# EAGLE design NixieDriver_overkill (EAGLE 7.1.0)
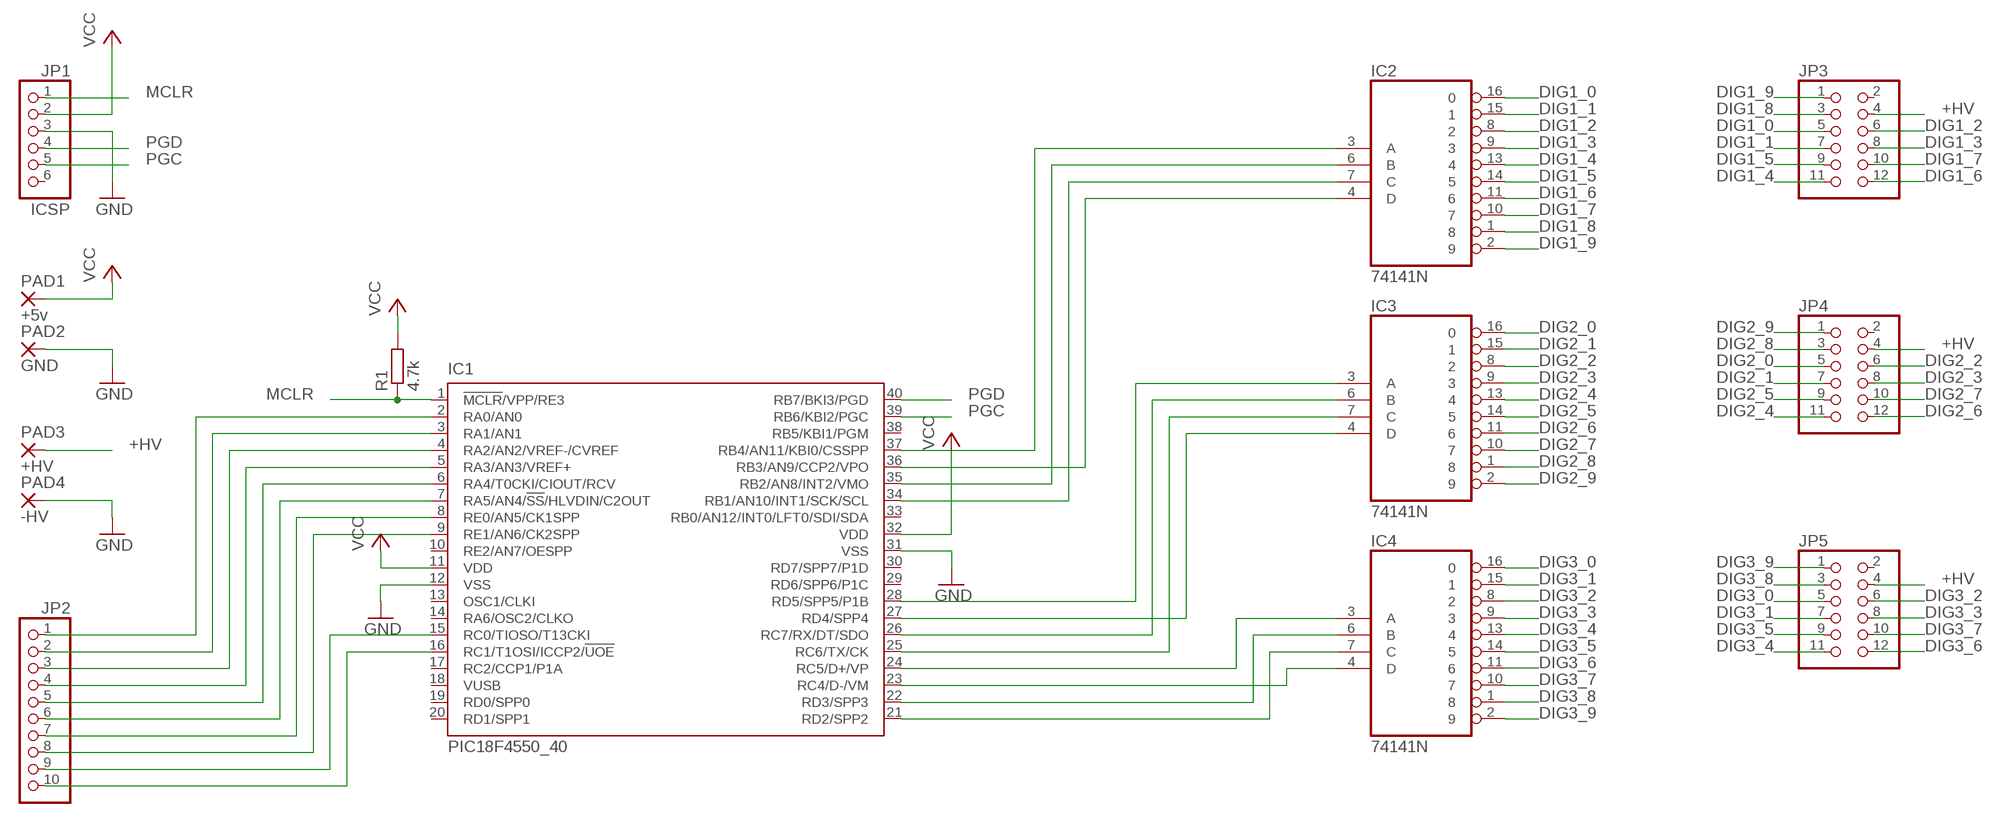
[diagram p0: schematic, sheet 1]

## Parts
IC1  PIC18F4550_40  [DIL40]
IC2  74141N  [DIL16]
IC3  74141N  [DIL16]
IC4  74141N  [DIL16]
JP1  ICSP  PINHD-1X6  [1X06]
JP2  PINHD-1X10  [1X10]
JP3  PINHD-2X6  [2X06]
JP4  PINHD-2X6  [2X06]
JP5  PINHD-2X6  [2X06]
PAD1  +5v  SMD5  [SMD2,54-5,08]
PAD2  GND  SMD5  [SMD2,54-5,08]
PAD3  +HV  SMD5  [SMD2,54-5,08]
PAD4  -HV  SMD5  [SMD2,54-5,08]
R1  4.7k  R-EU_R1206  [R1206]

## Nets
+HV: JP3.4 JP4.4 JP5.4 PAD3.1(P)
DIG1_0: IC2.16 JP3.5
DIG1_1: IC2.15 JP3.7
DIG1_2: IC2.8 JP3.6
DIG1_3: IC2.9 JP3.8
DIG1_4: IC2.13 JP3.11
DIG1_5: IC2.14 JP3.9
DIG1_6: IC2.11 JP3.12
DIG1_7: IC2.10 JP3.10
DIG1_8: IC2.1 JP3.3
DIG1_9: IC2.2 JP3.1
DIG2_0: IC3.16 JP4.5
DIG2_1: IC3.15 JP4.7
DIG2_2: IC3.8 JP4.6
DIG2_3: IC3.9 JP4.8
DIG2_4: IC3.13 JP4.11
DIG2_5: IC3.14 JP4.9
DIG2_6: IC3.11 JP4.12
DIG2_7: IC3.10 JP4.10
DIG2_8: IC3.1 JP4.3
DIG2_9: IC3.2 JP4.1
DIG3_0: IC4.16 JP5.5
DIG3_1: IC4.15 JP5.7
DIG3_2: IC4.8 JP5.6
DIG3_3: IC4.9 JP5.8
DIG3_4: IC4.13 JP5.11
DIG3_5: IC4.14 JP5.9
DIG3_6: IC4.11 JP5.12
DIG3_7: IC4.10 JP5.10
DIG3_8: IC4.1 JP5.3
DIG3_9: IC4.2 JP5.1
GND: IC1.12(VSS) IC1.31(VSS) JP1.3 PAD2.1(P) PAD4.1(P)
MCLR: IC1.1(!MCLR!/VPP/RE3) JP1.1 R1.1
N$32: IC1.24(RC5/D+/VP) IC4.3(A)
N$33: IC1.23(RC4/D-/VM) IC4.4(D)
N$34: IC1.22(RD3/SPP3) IC4.6(B)
N$35: IC1.21(RD2/SPP2) IC4.7(C)
N$36: IC1.25(RC6/TX/CK) IC3.7(C)
N$37: IC1.26(RC7/RX/DT/SDO) IC3.6(B)
N$38: IC1.27(RD4/SPP4) IC3.4(D)
N$39: IC1.28(RD5/SPP5/P1B) IC3.3(A)
N$40: IC1.34(RB1/AN10/INT1/SCK/SCL) IC2.7(C)
N$41: IC1.35(RB2/AN8/INT2/VMO) IC2.6(B)
N$42: IC1.36(RB3/AN9/CCP2/VPO) IC2.4(D)
N$43: IC1.37(RB4/AN11/KBI0/CSSPP) IC2.3(A)
N$44: IC1.2(RA0/AN0) JP2.1
N$45: IC1.3(RA1/AN1) JP2.2
N$46: IC1.4(RA2/AN2/VREF-/CVREF) JP2.3
N$47: IC1.5(RA3/AN3/VREF+) JP2.4
N$48: IC1.6(RA4/T0CKI/CIOUT/RCV) JP2.5
N$49: IC1.7(RA5/AN4/!SS!/HLVDIN/C2OUT) JP2.6
N$50: IC1.8(RE0/AN5/CK1SPP) JP2.7
N$51: IC1.9(RE1/AN6/CK2SPP) JP2.8
N$52: IC1.15(RC0/TIOSO/T13CKI) JP2.9
N$53: IC1.16(RC1/T1OSI/ICCP2/!UOE) JP2.10
PGC: IC1.39(RB6/KBI2/PGC) JP1.5
PGD: IC1.40(RB7/BKI3/PGD) JP1.4
VCC: IC1.11(VDD) IC1.32(VDD) JP1.2 PAD1.1(P) R1.2
Unconnected: IC1.10(RE2/AN7/OESPP) IC1.13(OSC1/CLKI) IC1.14(RA6/OSC2/CLKO) IC1.17(RC2/CCP1/P1A) IC1.18(VUSB) IC1.19(RD0/SPP0) IC1.20(RD1/SPP1) IC1.29(RD6/SPP6/P1C) IC1.30(RD7/SPP7/P1D) IC1.33(RB0/AN12/INT0/LFT0/SDI/SDA) IC1.38(RB5/KBI1/PGM) JP1.6 JP3.2 JP4.2 JP5.2

## Power pins joined to a net without a drawn wire
GND: IC2.12(GND) IC3.12(GND) IC4.12(GND)
VCC: IC2.5(VCC) IC3.5(VCC) IC4.5(VCC)

## Library data of the parts
IC1 = microchip:PIC18F4*_40: USB Microcontrollers with nanoWatt Technology High-Performance, Enhanced Flash, 28/40/44-Pin, Source: http://ww1.microchip.com/downloads/en/devicedoc/39632c.pdf; MF: MICROCHIP; MPN: PIC18F4550-I/P; OC_FARNELL: 9321357; OC_NEWARK: 74K8623
IC2-IC4 = 74xx-eu:74*141: BCD to decimal DECODER/DRIVER
JP1 = pinhead:PINHD-1X6: PIN HEADER
JP2 = pinhead:PINHD-1X10: PIN HEADER
JP3-JP5 = pinhead:PINHD-2X6: PIN HEADER
PAD1-PAD4 = wirepad:SMD5: SMD PAD
R1 = rcl:R-EU_: RESISTOR, European symbol

## Board
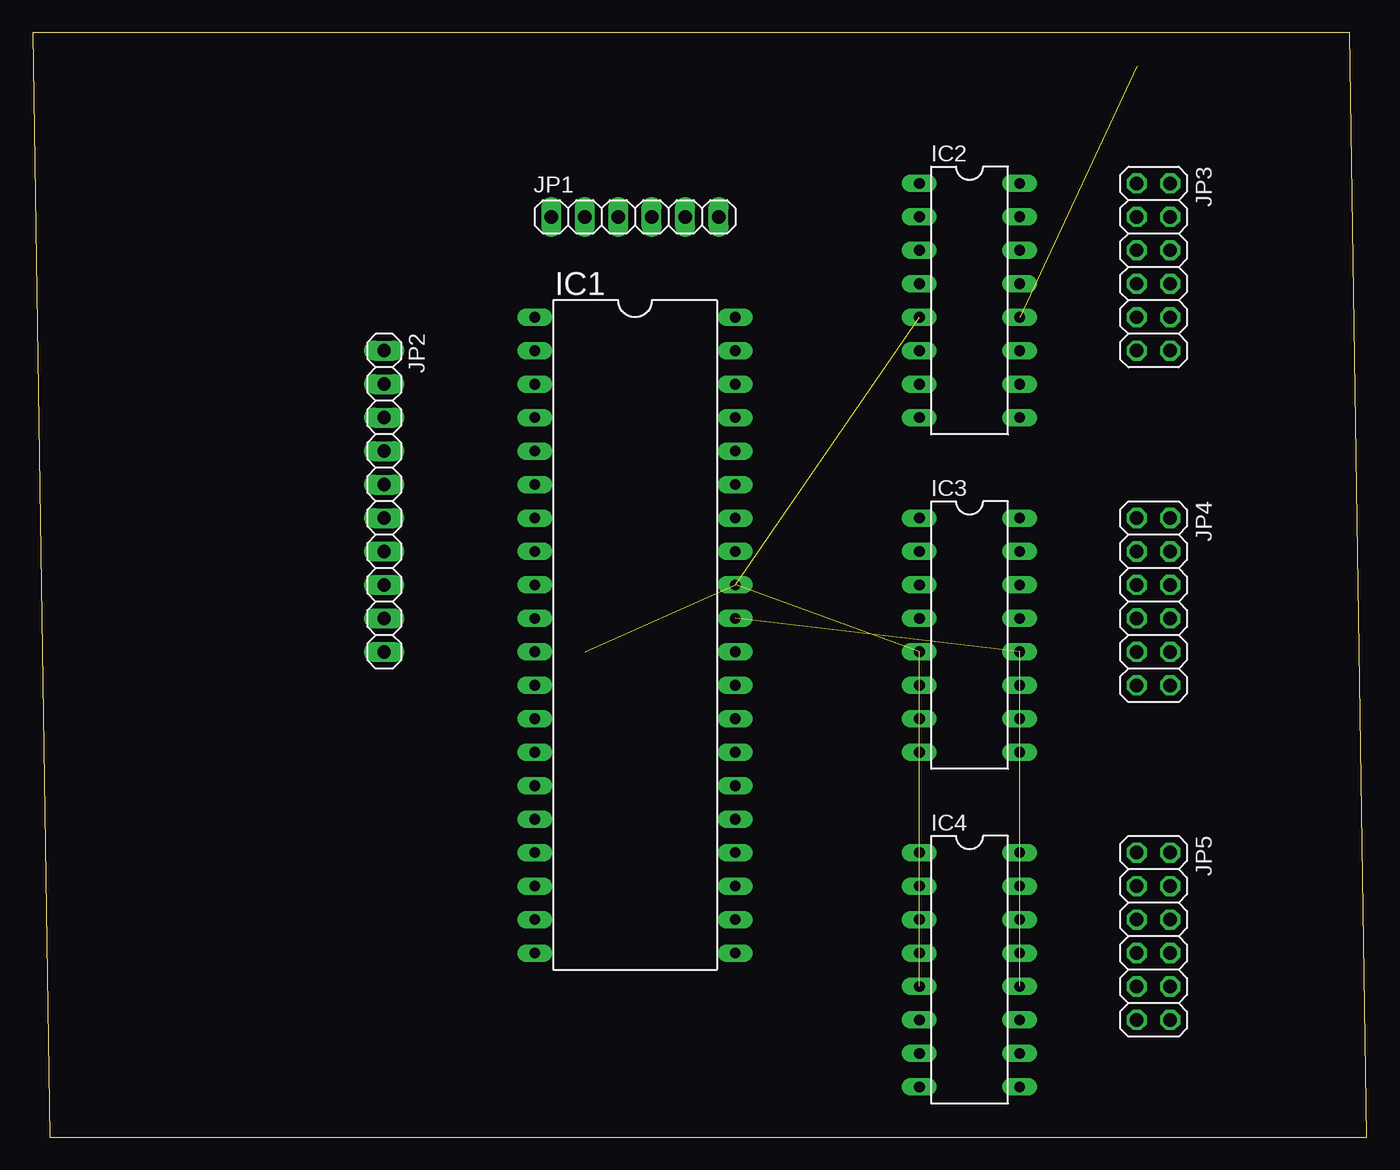
[diagram p1: board, top side]
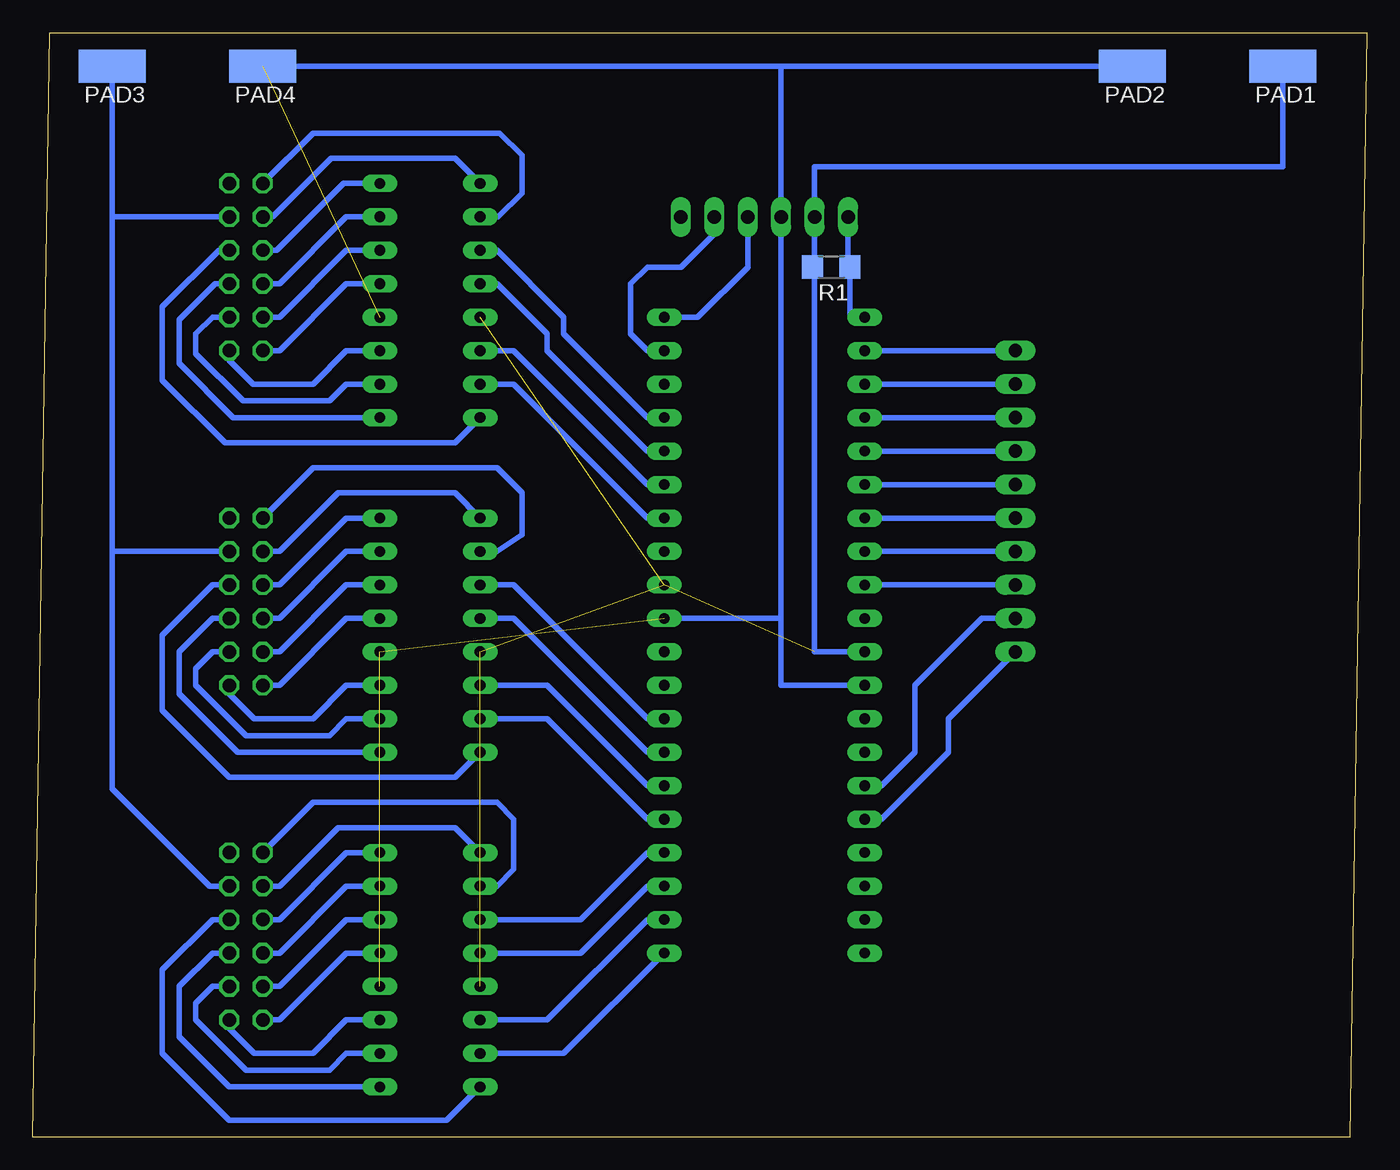
[diagram p2: board, bottom side, seen from below]

Size 101.27 x 83.81 mm. Coordinates in mm from the lower left corner, seen from the top.
Outline: 1.27,0 101.27,0 100,83.81 0,83.81 1.27,0
Copper layers (1*16): Top 0.035mm / dielectric 1.5mm / Bottom 0.035mm
Design rules "default": minimum track width 10mil, minimum drill 24mil, track to track 8mil, track to pad 8mil, pad to pad 8mil, via to via 8mil, smd to smd 8mil, copper to edge 40mil, drill to drill 8mil, minimum pad ring 10mil, minimum via ring 8mil, stop-mask expansion 4mil, vias tented up to drill 0mil, thermal gap 10mil

### Footprints (pad centres in the part's own frame; a part is rotated, then mirrored left to right if it is on the bottom)
DIL40 = drill 0.813 long: 1 -24.13,-7.62; 2 -21.59,-7.62; 3 -19.05,-7.62; 4 -16.51,-7.62; 5 -13.97,-7.62; 6 -11.43,-7.62; 7 -8.89,-7.62; 8 -6.35,-7.62; 9 -3.81,-7.62; 10 -1.27,-7.62; 11 1.27,-7.62; 12 3.81,-7.62; 13 6.35,-7.62; 14 8.89,-7.62; 15 11.43,-7.62; 16 13.97,-7.62; 17 16.51,-7.62; 18 19.05,-7.62; 19 21.59,-7.62; 20 24.13,-7.62; 21 24.13,7.62; 22 21.59,7.62; 23 19.05,7.62; 24 16.51,7.62; 25 13.97,7.62; 26 11.43,7.62; 27 8.89,7.62; 28 6.35,7.62; 29 3.81,7.62; 30 1.27,7.62; 31 -1.27,7.62; 32 -3.81,7.62; 33 -6.35,7.62; 34 -8.89,7.62; 35 -11.43,7.62; 36 -13.97,7.62; 37 -16.51,7.62; 38 -19.05,7.62; 39 -21.59,7.62; 40 -24.13,7.62
DIL16 = drill 0.813 long: 1 -8.89,-3.81; 2 -6.35,-3.81; 3 -3.81,-3.81; 4 -1.27,-3.81; 5 1.27,-3.81; 6 3.81,-3.81; 7 6.35,-3.81; 8 8.89,-3.81; 9 8.89,3.81; 10 6.35,3.81; 11 3.81,3.81; 12 1.27,3.81; 13 -1.27,3.81; 14 -3.81,3.81; 15 -6.35,3.81; 16 -8.89,3.81
1X06 = drill 1.016 long: 1 -6.35,0; 2 -3.81,0; 3 -1.27,0; 4 1.27,0; 5 3.81,0; 6 6.35,0
1X10 = drill 1.016 long: 1 -11.43,0; 2 -8.89,0; 3 -6.35,0; 4 -3.81,0; 5 -1.27,0; 6 1.27,0; 7 3.81,0; 8 6.35,0; 9 8.89,0; 10 11.43,0
2X06 = drill 1.016 octagon: 1 -6.35,-1.27; 2 -6.35,1.27; 3 -3.81,-1.27; 4 -3.81,1.27; 5 -1.27,-1.27; 6 -1.27,1.27; 7 1.27,-1.27; 8 1.27,1.27; 9 3.81,-1.27; 10 3.81,1.27; 11 6.35,-1.27; 12 6.35,1.27
SMD2,54-5,08 = smd 2.54 x 5.08: 1 0,0
R1206 = smd 1.6 x 1.803: 1 -1.422,0; 2 1.422,0

### Placement (x,y rotation side)
IC1  45.72,38.1 270 top
IC2  71.12,63.5 270 top
IC3  71.12,38.1 270 top
IC4  71.12,12.7 270 top
JP1  45.72,69.85 0 top
JP2  26.67,48.26 270 top
JP3  85.09,66.04 270 top
JP4  85.09,40.64 270 top
JP5  85.09,15.24 270 top
PAD1  6.35,81.28 90 bottom
PAD2  17.78,81.28 90 bottom
PAD3  95.25,81.28 90 bottom
PAD4  83.82,81.28 90 bottom
R1  40.64,66.04 180 bottom

### Tracks (layer width: path | path; a pad name or v marks a point on that pad's centre or on a via)
+HV
  Bottom 0.406: JP3.4 95.25,69.85 | 95.25,69.85 PAD3.1 | JP4.4 95.25,44.45 | 95.25,44.45 95.25,69.85 | JP5.4 87.84,19.05 95.25,26.45 95.25,44.45
DIG1_0
  Bottom 0.406: IC2.16 77.68,72.39 82.76,67.31 JP3.5
DIG1_1
  Bottom 0.406: IC2.15 77.47,69.85 82.55,64.77 JP3.7
DIG1_2
  Bottom 0.406: IC2.8 69.21,52.7 86.69,52.7 91.44,57.46 91.44,63.01 87.14,67.31 JP3.6
DIG1_3
  Bottom 0.406: IC2.9 86.05,54.61 90.17,58.73 90.17,62.02 87.42,64.77 JP3.8
DIG1_4
  Bottom 0.406: IC2.13 77.47,64.77 82.55,59.69 JP3.11
DIG1_5
  Bottom 0.406: IC2.14 77.47,67.31 82.55,62.23 JP3.9
DIG1_6
  Bottom 0.406: IC2.11 77.47,59.69 80.01,57.15 84.56,57.15 86.36,58.95 JP3.12
DIG1_7
  Bottom 0.406: JP3.10 87.63,62.23 88.9,60.96 88.9,59.47 85.31,55.88 78.74,55.88 77.47,57.15 IC2.10
DIG1_8
  Bottom 0.406: IC2.1 69.21,74.3 78.63,74.3 83.08,69.85 JP3.3
DIG1_9
  Bottom 0.406: IC2.2 65.93,69.85 64.14,71.65 64.14,74.51 65.82,76.2 80.01,76.2 JP3.1
DIG2_0
  Bottom 0.406: IC3.16 77.47,46.99 82.55,41.91 JP4.5
DIG2_1
  Bottom 0.406: IC3.15 77.47,44.45 82.55,39.37 JP4.7
DIG2_2
  Bottom 0.406: IC3.8 69.21,27.3 86.36,27.3 91.44,32.38 91.44,38.1 87.63,41.91 JP4.6
DIG2_3
  Bottom 0.406: IC3.9 85.72,29.21 90.17,33.66 90.17,36.83 87.63,39.37 JP4.8
DIG2_4
  Bottom 0.406: IC3.13 77.47,39.37 82.55,34.29 JP4.11
DIG2_5
  Bottom 0.406: IC3.14 77.47,41.91 82.55,36.83 JP4.9
DIG2_6
  Bottom 0.406: IC3.11 77.47,34.29 80.01,31.75 84.45,31.75 86.36,33.66 JP4.12
DIG2_7
  Bottom 0.406: IC3.10 77.47,31.75 78.74,30.48 85.09,30.48 88.9,34.29 88.9,35.56 87.63,36.83 JP4.10
DIG2_8
  Bottom 0.406: IC3.1 69.21,48.9 78.1,48.9 82.55,44.45 JP4.3
DIG2_9
  Bottom 0.406: IC3.2 66.04,44.45 64.14,45.72 64.14,48.9 66.04,50.8 80.01,50.8 JP4.1
DIG3_0
  Bottom 0.406: JP5.5 82.55,16.51 77.47,21.59 IC4.16
DIG3_1
  Bottom 0.406: JP5.7 82.55,13.97 77.47,19.05 IC4.15
DIG3_2
  Bottom 0.406: IC4.8 69.85,1.27 86.36,1.27 91.44,6.35 91.44,12.7 87.63,16.51 JP5.6
DIG3_3
  Bottom 0.406: IC4.9 86.36,3.81 90.17,7.62 90.17,11.43 87.63,13.97 JP5.8
DIG3_4
  Bottom 0.406: JP5.11 82.55,8.89 77.47,13.97 IC4.13
DIG3_5
  Bottom 0.406: JP5.9 82.55,11.43 77.47,16.51 IC4.14
DIG3_6
  Bottom 0.406: IC4.11 77.47,8.89 80.01,6.35 84.45,6.35 86.36,8.26 JP5.12
DIG3_7
  Bottom 0.406: IC4.10 77.47,6.35 78.74,5.08 85.09,5.08 88.9,8.89 88.9,10.16 87.63,11.43 JP5.10
DIG3_8
  Bottom 0.406: IC4.1 69.21,23.5 78.1,23.5 82.55,19.05 JP5.3
DIG3_9
  Bottom 0.406: IC4.2 66.04,19.05 64.77,20.32 64.77,24.13 66.04,25.4 80.01,25.4 JP5.1
GND  (3 unrouted)
  Bottom 0.406: PAD2.1 44.45,81.28 | 44.45,81.28 PAD4.1 | 44.45,81.28 JP1.3 44.45,39.37 | IC1.12 44.45,34.29 44.45,39.37 | IC1.31 44.45,39.37
MCLR
  Bottom 0.406: JP1.1 39.37,66.04 R1.1 39.22,62.23 IC1.1
N$32
  Bottom 0.406: IC1.24 54.61,21.59 59.69,16.51 IC4.3
N$33
  Bottom 0.406: IC1.23 54.61,19.05 59.69,13.97 IC4.4
N$34
  Bottom 0.406: IC1.22 54.61,16.51 62.23,8.89 IC4.6
N$35
  Bottom 0.406: IC1.21 60.96,6.35 IC4.7
N$36
  Bottom 0.406: IC1.25 54.61,24.13 62.23,31.75 IC3.7
N$37
  Bottom 0.406: IC1.26 54.61,26.67 62.23,34.29 IC3.6
N$38
  Bottom 0.406: IC1.27 54.61,29.21 64.77,39.37 IC3.4
N$39
  Bottom 0.406: IC1.28 54.61,31.75 64.77,41.91 IC3.3
N$40
  Bottom 0.406: IC1.34 54.61,46.99 64.77,57.15 IC2.7
N$41
  Bottom 0.406: IC1.35 54.61,49.53 64.77,59.69 IC2.6
N$42
  Bottom 0.406: IC1.36 54.61,52.07 62.23,59.69 62.23,60.96 66.04,64.77 IC2.4
N$43
  Bottom 0.406: IC1.37 54.61,54.61 60.96,60.96 60.96,62.23 66.04,67.31 IC2.3
N$44
  Bottom 0.406: JP2.1 IC1.2
N$45
  Bottom 0.406: IC1.3 JP2.2
N$46
  Bottom 0.406: JP2.3 IC1.4
N$47
  Bottom 0.406: IC1.5 JP2.4
N$48
  Bottom 0.406: JP2.5 IC1.6
N$49
  Bottom 0.406: JP2.6 IC1.7
N$50
  Bottom 0.406: JP2.7 IC1.8
N$51
  Bottom 0.406: JP2.8 IC1.9
N$52
  Bottom 0.406: JP2.9 29.21,39.37 34.29,34.29 34.29,29.21 36.83,26.67 IC1.15
N$53
  Bottom 0.406: JP2.10 31.75,31.75 31.75,29.21 36.83,24.13 IC1.16
PGC
  Bottom 0.406: JP1.5 49.53,68.58 52.07,66.04 54.61,66.04 55.88,64.77 55.88,60.96 54.61,59.69 IC1.39
PGD
  Bottom 0.406: JP1.4 46.99,66.04 50.8,62.23 IC1.40
VCC  (4 unrouted)
  Bottom 0.406: PAD1.1 6.35,73.66 41.91,73.66 JP1.2 41.91,66.04 R1.2 41.91,65.89 41.91,36.83 IC1.11